# EAGLE design BootSel-Atmega (EAGLE 8.5.1)
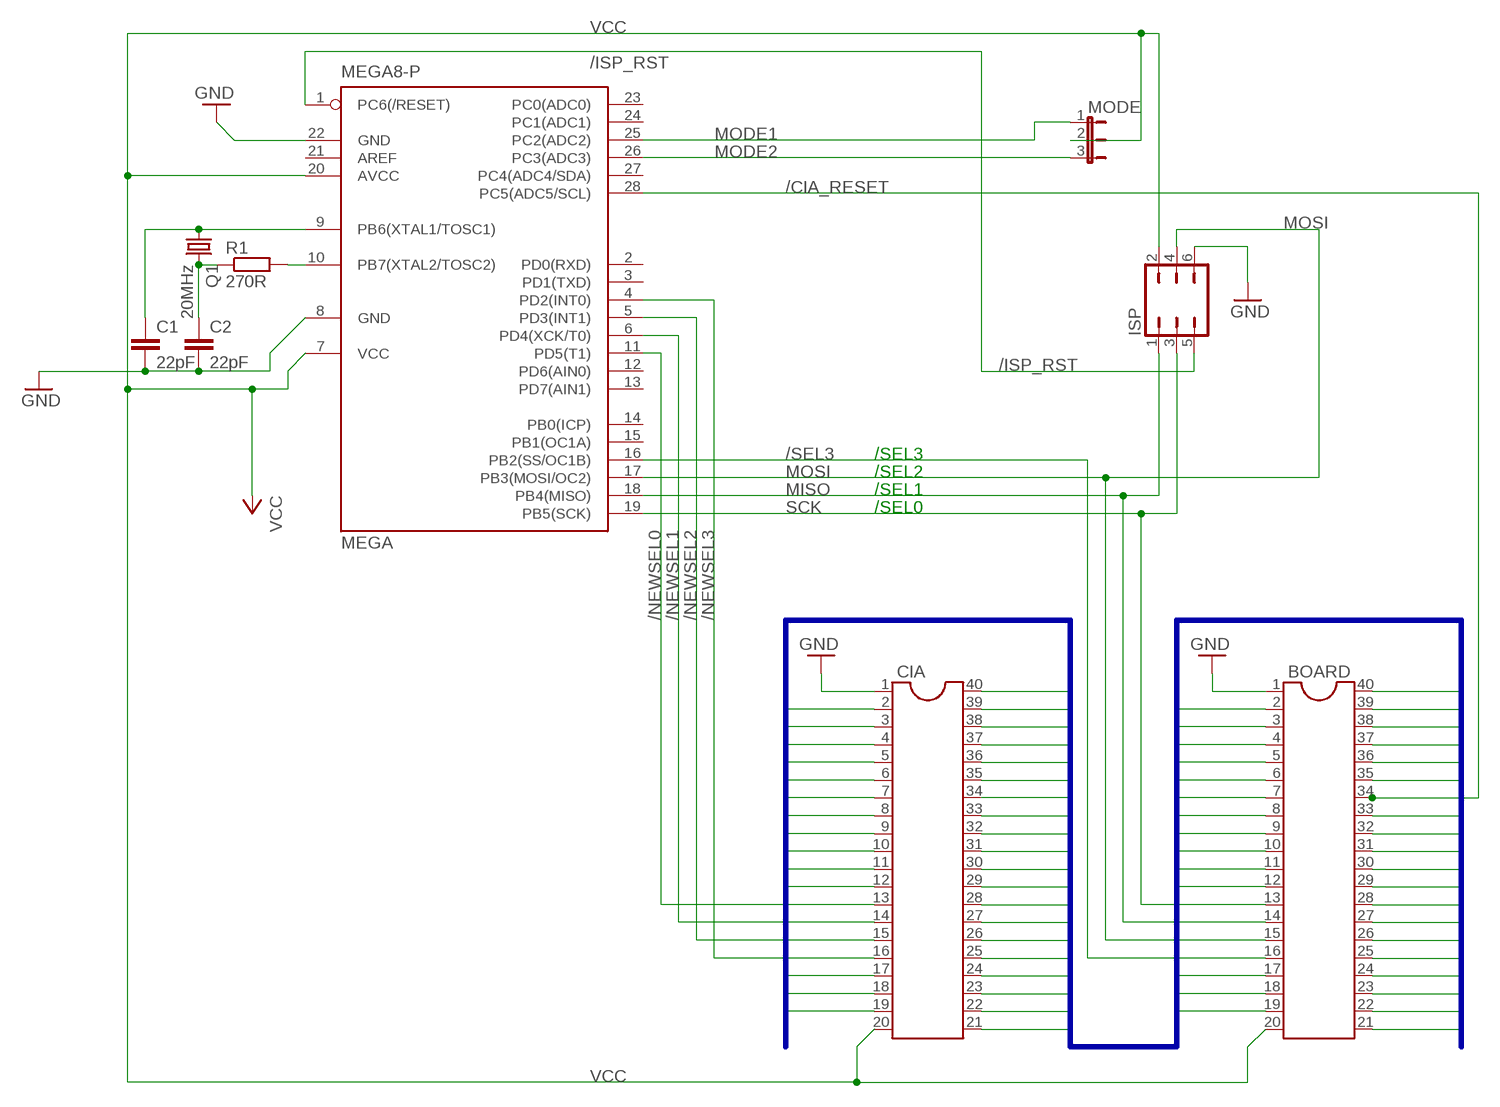
[diagram p0: schematic, sheet 1]

## Parts
BOARD  DIL40  [DIL40]
C1  22pF  C2.5/4  [C2.5-4]
C2  22pF  C2.5/4  [C2.5-4]
CIA  DIL40  [DIL40]
ISP  JP3Q  [JP3Q]
MEGA  MEGA8-P  [DIL28-3]
MODE  JP2E  [JP2]
Q1  20MHz  CRYSTALHC49S  [HC49/S]
R1  270R  R-EU_0204/5  [0204/5]

## Nets
/CIA_RESET: BOARD.34 CIA.34 MEGA.28(PC5(ADC5/SCL))
/ISP_RST: ISP.5 MEGA.1(PC6(/RESET))
/NEWSEL0: CIA.13 MEGA.11(PD5(T1))
/NEWSEL1: CIA.14 MEGA.6(PD4(XCK/T0))
/NEWSEL2: CIA.15 MEGA.5(PD3(INT1))
/NEWSEL3: CIA.16 MEGA.4(PD2(INT0))
/SEL3: BOARD.16 MEGA.16(PB2(SS/OC1B))
CIA2: BOARD.2 CIA.2
CIA3: BOARD.3 CIA.3
CIA4: BOARD.4 CIA.4
CIA5: BOARD.5 CIA.5
CIA6: BOARD.6 CIA.6
CIA7: BOARD.7 CIA.7
CIA8: BOARD.8 CIA.8
CIA9: BOARD.9 CIA.9
CIA10: BOARD.10 CIA.10
CIA11: BOARD.11 CIA.11
CIA12: BOARD.12 CIA.12
CIA17: BOARD.17 CIA.17
CIA18: BOARD.18 CIA.18
CIA19: BOARD.19 CIA.19
CIA21: BOARD.21 CIA.21
CIA22: BOARD.22 CIA.22
CIA23: BOARD.23 CIA.23
CIA24: BOARD.24 CIA.24
CIA25: BOARD.25 CIA.25
CIA26: BOARD.26 CIA.26
CIA27: BOARD.27 CIA.27
CIA28: BOARD.28 CIA.28
CIA29: BOARD.29 CIA.29
CIA30: BOARD.30 CIA.30
CIA31: BOARD.31 CIA.31
CIA32: BOARD.32 CIA.32
CIA33: BOARD.33 CIA.33
CIA35: BOARD.35 CIA.35
CIA36: BOARD.36 CIA.36
CIA37: BOARD.37 CIA.37
CIA38: BOARD.38 CIA.38
CIA39: BOARD.39 CIA.39
CIA40: BOARD.40 CIA.40
GND: BOARD.1 C1.2 C2.2 CIA.1 ISP.6 MEGA.8(GND) MEGA.22(GND)
MISO: BOARD.14 ISP.1 MEGA.18(PB4(MISO))
MODE1: MEGA.25(PC2(ADC2)) MODE.1
MODE2: MEGA.26(PC3(ADC3)) MODE.3
MOSI: BOARD.15 ISP.4 MEGA.17(PB3(MOSI/OC2))
N$1: MEGA.10(PB7(XTAL2/TOSC2)) R1.2
N$16: C2.1 Q1.2 R1.1
N$17: C1.1 MEGA.9(PB6(XTAL1/TOSC1)) Q1.1
SCK: BOARD.13 ISP.3 MEGA.19(PB5(SCK))
VCC: BOARD.20 CIA.20 ISP.2 MEGA.7(VCC) MEGA.20(AVCC) MODE.2
Unconnected: MEGA.2(PD0(RXD)) MEGA.3(PD1(TXD)) MEGA.12(PD6(AIN0)) MEGA.13(PD7(AIN1)) MEGA.14(PB0(ICP)) MEGA.15(PB1(OC1A)) MEGA.21(AREF) MEGA.23(PC0(ADC0)) MEGA.24(PC1(ADC1)) MEGA.27(PC4(ADC4/SDA))

## Buses
CIA[1..40],/CIA_RESET

## Notes on the sheet
- /SEL3
- /SEL2
- /SEL1
- /SEL0

## Library data of the parts
BOARD CIA = ic-package:DIL40: Dual In Line
C1 C2 = capacitor-wima:C: CAPACITOR naming: grid - package width
ISP = jumper:JP3Q: JUMPER
MEGA = atmel:MEGA8-P: MICROCONTROLLER 8 Kbytes FLASH, 1 kbytes SRAM, 512 bytes EEPROM, USART, 4-channel 10 bit ADC, 2-channel 8 bit ADC Pin compatible with Atmega48, ATMega88, ATMega168 Source: avr.lbr; OC_FARNELL: unknown; OC_NEWARK: unknown
MODE = jumper:JP2E: JUMPER
Q1 = crystal:CRYSTAL: CRYSTAL; OC_FARNELL: 1667008; OC_NEWARK: unknown
R1 = resistor:R-EU_: RESISTOR, European symbol

## Board
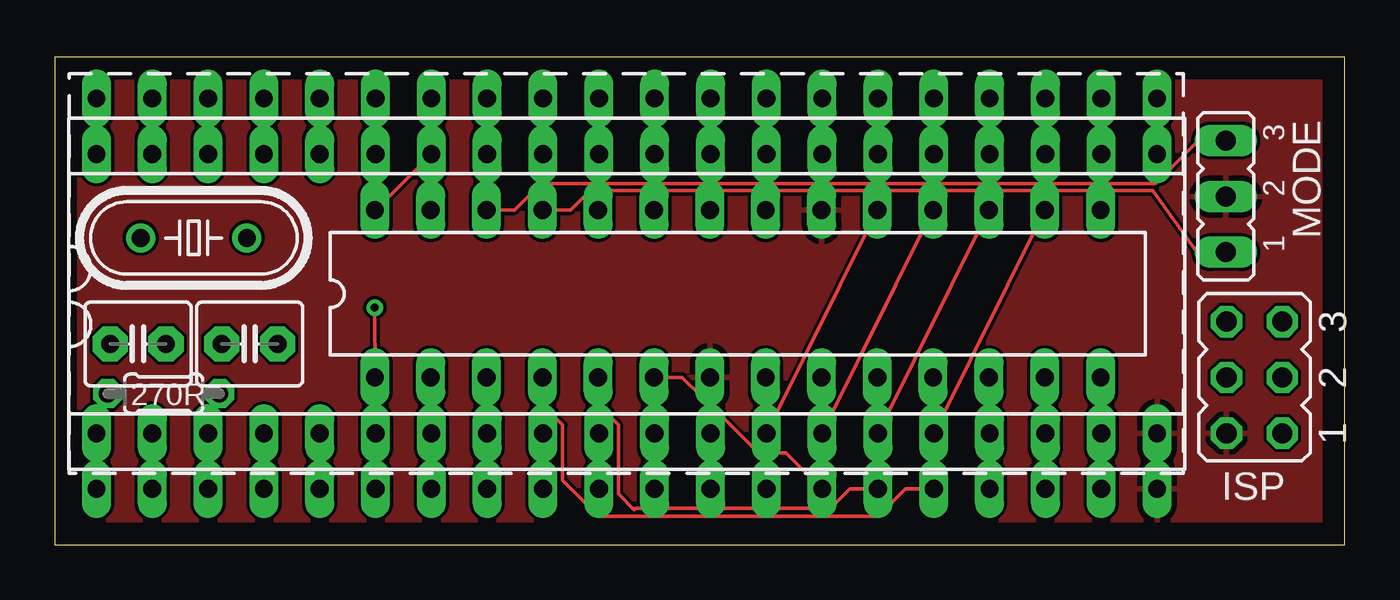
[diagram p1: board, top side]
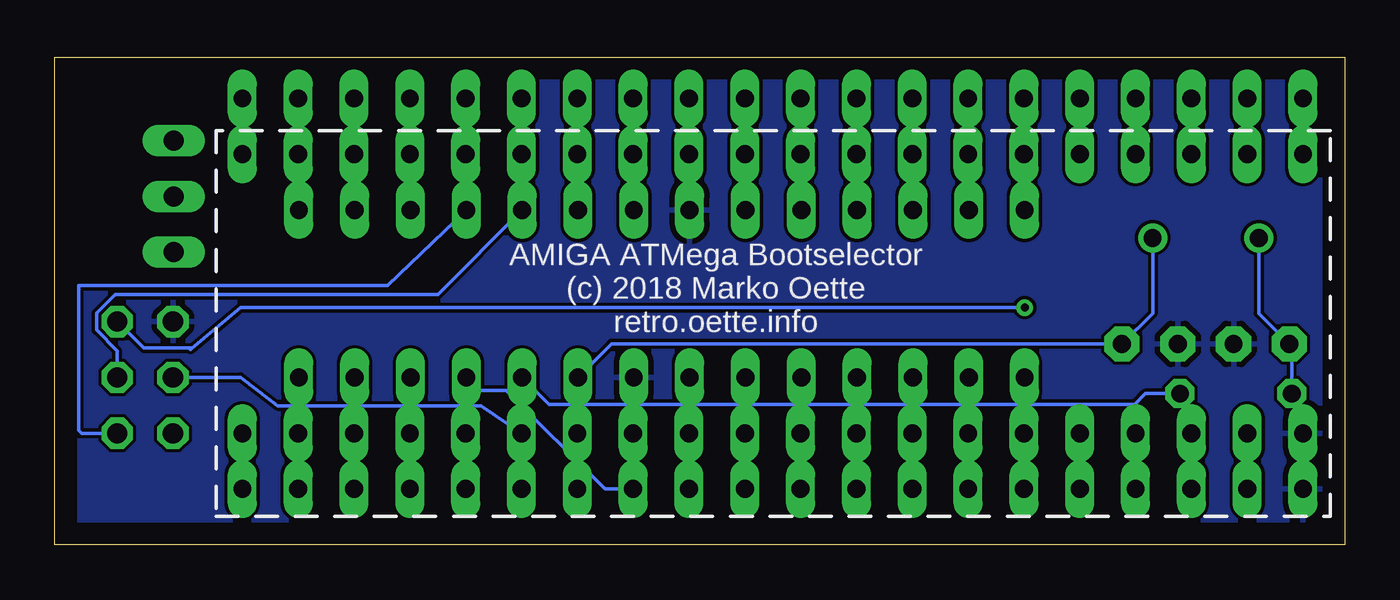
[diagram p2: board, bottom side, seen from below]

Size 58.68 x 22.2 mm. Coordinates in mm from the lower left corner, seen from the top.
Outline: 0,0 58.68,0 58.68,22.2 0,22.2 0,0
Copper layers (1*16): Top 0.035mm / dielectric 1.5mm / Bottom 0.035mm
Design rules "default *": minimum track width 6mil, minimum drill 0.35mm, track to track 6mil, track to pad 6mil, pad to pad 6mil, via to via 6mil, smd to smd 6mil, copper to edge 40mil, drill to drill 6mil, minimum pad ring 10mil, minimum via ring 8mil, stop-mask expansion 4mil, vias tented up to drill 0mil, thermal gap 10mil

### Footprints (pad centres in the part's own frame; a part is rotated, then mirrored left to right if it is on the bottom)
DIL40 = drill 0.813 long: 1 -24.13,-7.62; 2 -21.59,-7.62; 3 -19.05,-7.62; 4 -16.51,-7.62; 5 -13.97,-7.62; 6 -11.43,-7.62; 7 -8.89,-7.62; 8 -6.35,-7.62; 9 -3.81,-7.62; 10 -1.27,-7.62; 11 1.27,-7.62; 12 3.81,-7.62; 13 6.35,-7.62; 14 8.89,-7.62; 15 11.43,-7.62; 16 13.97,-7.62; 17 16.51,-7.62; 18 19.05,-7.62; 19 21.59,-7.62; 20 24.13,-7.62; 21 24.13,7.62; 22 21.59,7.62; 23 19.05,7.62; 24 16.51,7.62; 25 13.97,7.62; 26 11.43,7.62; 27 8.89,7.62; 28 6.35,7.62; 29 3.81,7.62; 30 1.27,7.62; 31 -1.27,7.62; 32 -3.81,7.62; 33 -6.35,7.62; 34 -8.89,7.62; 35 -11.43,7.62; 36 -13.97,7.62; 37 -16.51,7.62; 38 -19.05,7.62; 39 -21.59,7.62; 40 -24.13,7.62
C2.5-4 = drill 0.813 pad 1.6 octagon: 1 -1.27,0; 2 1.27,0
JP3Q = drill 0.914 octagon: 1 -2.54,-1.27; 2 -2.54,1.27; 3 0,-1.27; 4 0,1.27; 5 2.54,-1.27; 6 2.54,1.27
DIL28-3 = drill 0.813 long: 1 -16.51,-3.81; 2 -13.97,-3.81; 3 -11.43,-3.81; 4 -8.89,-3.81; 5 -6.35,-3.81; 6 -3.81,-3.81; 7 -1.27,-3.81; 8 1.27,-3.81; 9 3.81,-3.81; 10 6.35,-3.81; 11 8.89,-3.81; 12 11.43,-3.81; 13 13.97,-3.81; 14 16.51,-3.81; 15 16.51,3.81; 16 13.97,3.81; 17 11.43,3.81; 18 8.89,3.81; 19 6.35,3.81; 20 3.81,3.81; 21 1.27,3.81; 22 -1.27,3.81; 23 -3.81,3.81; 24 -6.35,3.81; 25 -8.89,3.81; 26 -11.43,3.81; 27 -13.97,3.81; 28 -16.51,3.81
JP2 = drill 0.914 long: 1 -2.54,0; 2 0,0; 3 2.54,0
HC49/S = drill 0.813: 1 -2.413,0; 2 2.413,0
0204/5 = drill 0.813 octagon: 1 -2.54,0; 2 2.54,0

### Placement (x,y rotation side)
BOARD  26.02,12.7 0 top
C1  8.86,9.14 180 top
C2  3.78,9.14 0 top
CIA  26.02,10.16 0 top
ISP  54.58,7.62 90 top
MEGA  31.07,11.43 0 top
MODE  53.28,15.86 90 top
Q1  6.32,13.97 180 top
R1  4.95,6.88 0 top

### Tracks (layer width: path | path; a pad name or v marks a point on that pad's centre or on a via)
/CIA_RESET
  Top 0.152: BOARD.34 CIA.34 14.59,15.24 MEGA.28
/ISP_RST  (via drill 0.35)
  Top 0.152: v14.55,10.8 MEGA.1
  Bottom 0.152: 52.5,8.9 52.52,8.9 52.47,8.94 | ISP.5 54.64,8.96 52.48,8.96 52.47,8.94 | 52.47,8.94 50.22,10.8 v14.55,10.8
/NEWSEL0
  Bottom 0.152: MEGA.11 39.38,7.04 38.15,7.04 33.65,2.54 CIA.13
/NEWSEL1
  Top 0.152: CIA.14 33.26,4.19 32,4.19 29.46,6.73 29.43,6.73 28.54,7.62 MEGA.6
/NEWSEL2
  Top 0.152: CIA.15 36.17,2.54 35.28,1.65 26.4,1.65 26.35,1.6 25.64,2.31 25.64,5.45 24.72,6.37 MEGA.5
/NEWSEL3
  Top 0.152: CIA.16 38.71,2.54 37.46,1.29 24.74,1.29 23.1,2.93 23.1,5.45 22.18,6.37 MEGA.4
/SEL3
  Top 0.152: MEGA.16 BOARD.16
CIA2
  Top 0.152: BOARD.2 CIA.2
CIA3
  Top 0.152: BOARD.3 CIA.3
CIA4
  Top 0.152: BOARD.4 CIA.4
CIA5
  Top 0.152: BOARD.5 CIA.5
CIA6
  Top 0.152: BOARD.6 CIA.6
CIA7
  Top 0.152: BOARD.7 CIA.7
CIA8
  Top 0.152: BOARD.8 CIA.8
CIA9
  Top 0.152: BOARD.9 CIA.9
CIA10
  Top 0.152: BOARD.10 CIA.10
CIA11
  Top 0.152: BOARD.11 CIA.11
CIA12
  Top 0.152: BOARD.12 CIA.12
CIA17
  Top 0.152: BOARD.17 CIA.17
CIA18
  Top 0.152: BOARD.18 CIA.18
CIA19
  Top 0.152: BOARD.19 CIA.19
CIA21
  Top 0.152: BOARD.21 CIA.21
CIA22
  Top 0.152: BOARD.22 CIA.22
CIA23
  Top 0.152: BOARD.23 CIA.23
CIA24
  Top 0.152: BOARD.24 CIA.24
CIA25
  Top 0.152: BOARD.25 CIA.25
CIA26
  Top 0.152: BOARD.26 CIA.26
CIA27
  Top 0.152: BOARD.27 CIA.27
CIA28
  Top 0.152: BOARD.28 CIA.28
CIA29
  Top 0.152: BOARD.29 CIA.29
CIA30
  Top 0.152: BOARD.30 CIA.30
CIA31
  Top 0.152: BOARD.31 CIA.31
CIA32
  Top 0.152: BOARD.32 CIA.32
CIA33
  Top 0.152: BOARD.33 CIA.33
CIA35
  Top 0.152: BOARD.35 CIA.35
CIA36
  Top 0.152: BOARD.36 CIA.36
CIA37
  Top 0.152: BOARD.37 CIA.37
CIA38
  Top 0.152: BOARD.38 CIA.38
CIA39
  Top 0.152: BOARD.39 CIA.39
CIA40
  Top 0.152: BOARD.40 CIA.40
GND
  pour Bottom: 58.36,22.21 58.36,0 0,0 0,22.21
MISO
  Top 0.152: MEGA.18 BOARD.14
  Bottom 0.152: ISP.1 57.47,5.08 57.59,5.2 57.59,11.8 43.55,11.8 MEGA.18
MODE1
  Top 0.152: MEGA.25 23.46,15.24 24.35,16.13 49.95,16.13 51.96,13.32 MODE.1
MODE2
  Top 0.152: MEGA.26 20.92,15.24 22.12,16.43 50.06,16.43 52.03,18.4 MODE.3
MOSI
  Top 0.152: MEGA.17 BOARD.15
  Bottom 0.152: ISP.4 50.24,7.62 48.55,6.33 39.3,6.33 BOARD.15
N$1
  Bottom 0.152: R1.2 9.07,6.88 9.55,6.4 36.2,6.4 MEGA.10
N$16
  Bottom 0.152: Q1.2 3.91,10.54 C2.1 2.41,9.04 R1.1
N$17
  Bottom 0.152: Q1.1 8.73,10.54 C1.1 33.36,9.14 MEGA.9
SCK
  Top 0.152: MEGA.19 BOARD.13
  Bottom 0.152: MEGA.19 41.26,11.4 55.93,11.4 56.79,10.55 56.79,9.77 55.85,8.83 ISP.3
VCC
  pour Top: 0,22.21 58.36,22.21 58.36,0 0,0

### Text on the board
bNames: AMIGA ATMega Bootselector / (c) 2018 Marko Oette / retro.oette.info